# Altium schematic sheet STM32F7.SchDoc
size C
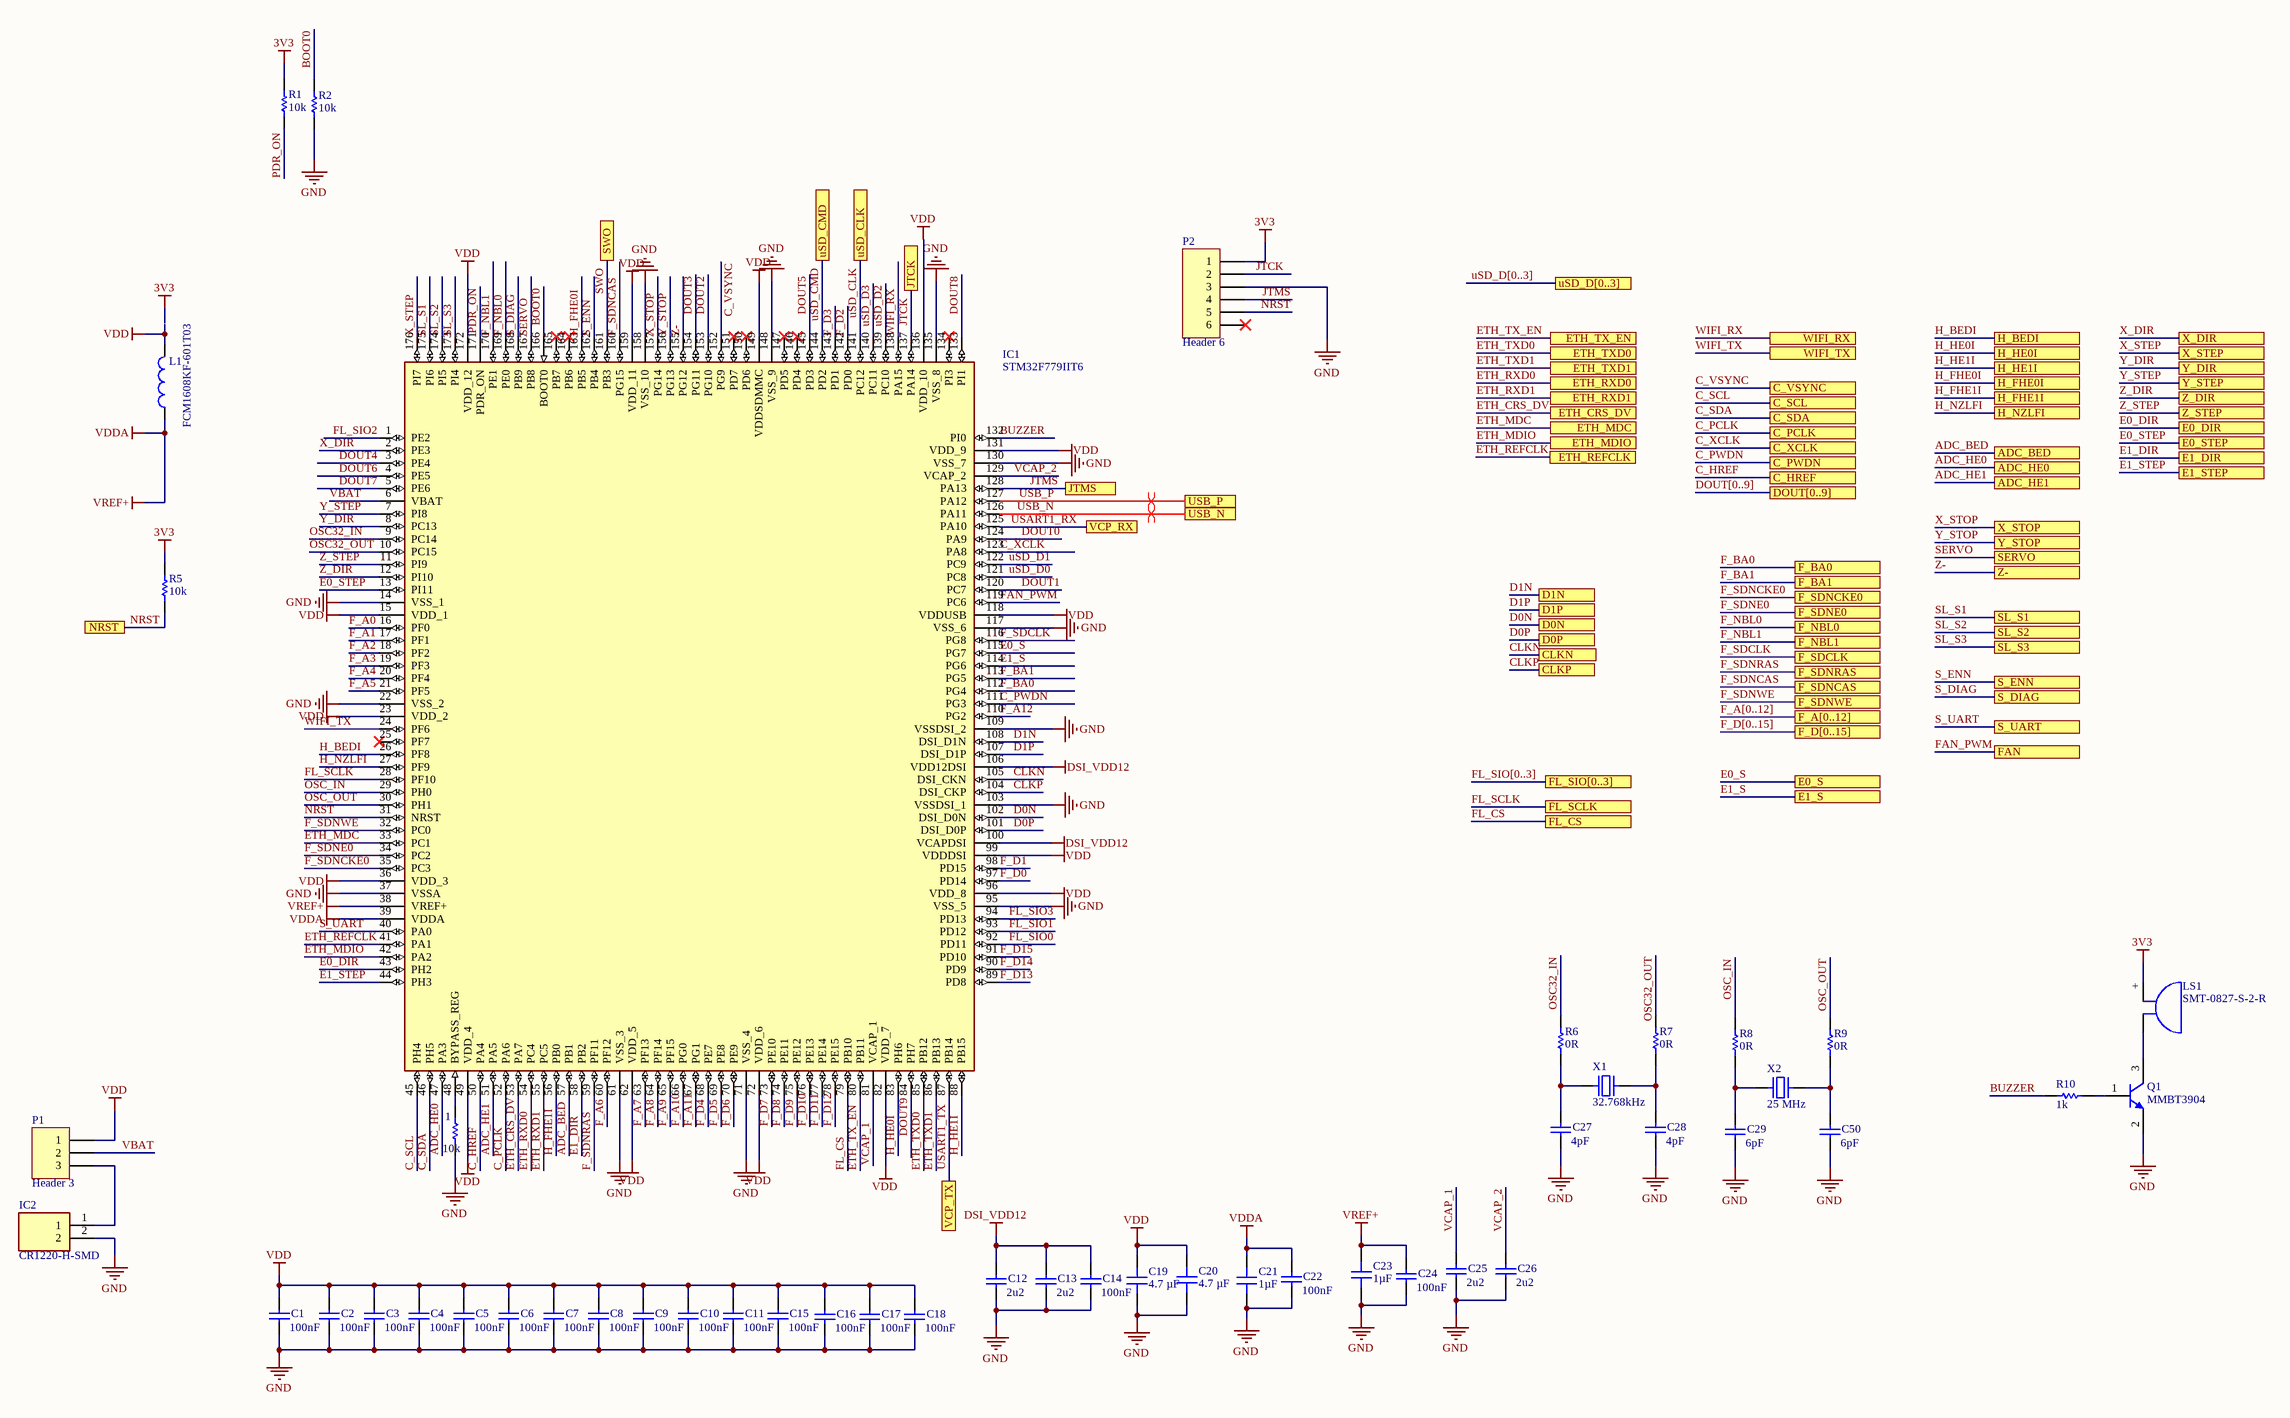
[diagram p0: STM32F7.SchDoc]

## Parts
1  value 10k  [1608[0603]]  (hidden comment: Res1)
C1  value 100nF  [1608[0603]]  (hidden comment: X5R)
C2  value 100nF  [1608[0603]]  (hidden comment: X5R)
C3  value 100nF  [1608[0603]]  (hidden comment: X5R)
C4  value 100nF  [1608[0603]]  (hidden comment: X5R)
C5  value 100nF  [1608[0603]]  (hidden comment: X5R)
C6  value 100nF  [1608[0603]]  (hidden comment: X5R)
C7  value 100nF  [1608[0603]]  (hidden comment: X5R)
C8  value 100nF  [1608[0603]]  (hidden comment: X5R)
C9  value 100nF  [1608[0603]]  (hidden comment: X5R)
C10  value 100nF  [1608[0603]]  (hidden comment: X5R)
C11  value 100nF  [1608[0603]]  (hidden comment: X5R)
C12  value 2u2  [1608[0603]]  (hidden comment: X5R)
C13  value 2u2  [1608[0603]]  (hidden comment: X5R)
C14  value 100nF  [1608[0603]]  (hidden comment: X5R)
C15  value 100nF  [1608[0603]]  (hidden comment: X5R)
C16  value 100nF  [1608[0603]]  (hidden comment: X5R)
C17  value 100nF  [1608[0603]]  (hidden comment: X5R)
C18  value 100nF  [1608[0603]]  (hidden comment: X5R)
C19  4.7 µF  [CAP 0603_1608]
C20  4.7 µF  [CAP 0603_1608]
C21  1µF  [CAP 0603_1608]
C22  value 100nF  [1608[0603]]  (hidden comment: X5R)
C23  1µF  [CAP 0603_1608]
C24  value 100nF  [1608[0603]]  (hidden comment: X5R)
C25  value 2u2  [1608[0603]]  (hidden comment: X5R)
C26  value 2u2  [1608[0603]]  (hidden comment: X5R)
C27  value 4pF  [1608[0603]]  (hidden comment: X5R)
C28  value 4pF  [1608[0603]]  (hidden comment: X5R)
C29  value 6pF  [1608[0603]]  (hidden comment: X5R)
C50  value 6pF  [1608[0603]]  (hidden comment: X5R)
IC1  STM32F779IIT6  [QFP50P2600X2600X160-176N]
IC2  CR1220-H-SMD  [CR1220HSMD]
L1  FCM1608KF-601T03  [0603L]
LS1  SMT-0827-S-2-R  [PUI Audio SMT-0827-S-2-R]
P1  Header 3  [HDR1X3]
P2  Header 6  [HDR1X6]
Q1  MMBT3904  [SOT-23_N]
R1  value 10k  [1608[0603]]  (hidden comment: Res1)
R2  value 10k  [1608[0603]]  (hidden comment: Res1)
R5  value 10k  [1608[0603]]  (hidden comment: Res1)
R6  value 0R  [1608[0603]]  (hidden comment: Res1)
R7  value 0R  [1608[0603]]  (hidden comment: Res1)
R8  value 0R  [1608[0603]]  (hidden comment: Res1)
R9  value 0R  [1608[0603]]  (hidden comment: Res1)
R10  value 1k  [1608[0603]]  (hidden comment: Res1)
X1  32.768kHz  [NDK NX5032GA]
X2  25 MHz  [NDK NX5032GA]

## Ports
ADC_BED, ADC_HE0, ADC_HE1, C_HREF, C_PCLK, C_PWDN, C_SCL, C_SDA, C_VSYNC, C_XCLK, CLKN, CLKP, D0N, D0P, D1N, D1P, DOUT[0..9], E0_DIR, E0_S, E0_STEP, E1_DIR, E1_S, E1_STEP, ETH_CRS_DV, ETH_MDC, ETH_MDIO, ETH_REFCLK, ETH_RXD0, ETH_RXD1, ETH_TX_EN, ETH_TXD0, ETH_TXD1, F_A[0..12], F_BA0, F_BA1, F_D[0..15], F_NBL0, F_NBL1, F_SDCLK, F_SDNCAS, F_SDNCKE0, F_SDNE0, F_SDNRAS, F_SDNWE, FAN, FL_CS, FL_SCLK, FL_SIO[0..3], H_BEDI, H_FHE0I, H_FHE1I, H_HE0I, H_HE1I, H_NZLFI, JTCK, JTMS, NRST, S_DIAG, S_ENN, S_UART, SERVO, SL_S1, SL_S2, SL_S3, SWO, USB_N, USB_P, uSD_CLK, uSD_CMD, uSD_D[0..3], VCP_RX, VCP_TX, WIFI_RX, WIFI_TX, X_DIR, X_STEP, X_STOP, Y_DIR, Y_STEP, Y_STOP, Z-, Z_DIR, Z_STEP

## Nets
3V3: LS1.+ P2.1 R1.1 R5.1
DSI_VDD12: C12.1 C13.1 C14.1 IC1.100(VCAPDSI) IC1.106(VDD12DSI)
GND: 1.2 C1.2 C2.2 C3.2 C4.2 C5.2 C6.2 C7.2 C8.2 C9.2 C10.2 C11.2 C12.2 C13.2 C14.2 C15.2 C16.2 C17.2 C18.2 C19.1 C20.1 C21.1 C22.2 C23.1 C24.2 C25.2 C26.2 C27.2 C28.2 C29.2 C50.2 IC1.14(VSS_1) IC1.22(VSS_2) IC1.37(VSSA) IC1.61(VSS_3) IC1.71(VSS_4) IC1.95(VSS_5) IC1.103(VSSDSI_1) IC1.109(VSSDSI_2) IC1.117(VSS_6) IC1.130(VSS_7) IC1.135(VSS_8) IC1.148(VSS_9) IC1.158(VSS_10) IC2.2 P2.3 Q1.2(E) R2.2
VDD: C1.1 C2.1 C3.1 C4.1 C5.1 C6.1 C7.1 C8.1 C9.1 C10.1 C11.1 C15.1 C16.1 C17.1 C18.1 C19.2 C20.2 IC1.15(VDD_1) IC1.23(VDD_2) IC1.36(VDD_3) IC1.49(VDD_4) IC1.62(VDD_5) IC1.72(VDD_6) IC1.82(VDD_7) IC1.96(VDD_8) IC1.99(VDDDSI) IC1.118(VDDUSB) IC1.131(VDD_9) IC1.136(VDD_10) IC1.149(VDDSDMMC) IC1.159(VDD_11) IC1.172(VDD_12) L1.2 P1.1
VDDA: C21.2 C22.1 C23.2 C24.1 IC1.38(VREF+) IC1.39(VDDA) L1.1  [also labelled VREF+]
ADC_BED: IC1.57(PB1) ; port ADC_BED
ADC_HE0: IC1.47(PA3) ; port ADC_HE0
ADC_HE1: IC1.51(PA5) ; port ADC_HE1
BOOT0: IC1.166(BOOT0) R2.1
BUZZER: IC1.132(PI0) R10.1
C_HREF: IC1.50(PA4) ; port C_HREF
C_PCLK: IC1.52(PA6) ; port C_PCLK
C_PWDN: IC1.111(PG3) ; port C_PWDN
C_SCL: IC1.45(PH4) ; port C_SCL
C_SDA: IC1.46(PH5) ; port C_SDA
C_VSYNC: IC1.152(PG9) ; port C_VSYNC
C_XCLK: IC1.123(PA8) ; port C_XCLK
CLKN: IC1.105(DSI_CKN) ; port CLKN
CLKP: IC1.104(DSI_CKP) ; port CLKP
D0N: IC1.102(DSI_D0N) ; port D0N
D0P: IC1.101(DSI_D0P) ; port D0P
D1N: IC1.108(DSI_D1N) ; port D1N
D1P: IC1.107(DSI_D1P) ; port D1P
DOUT0: IC1.124(PA9)
DOUT1: IC1.120(PC7)
DOUT2: IC1.153(PG10)
DOUT3: IC1.154(PG11)
DOUT4: IC1.3(PE4)
DOUT5: IC1.145(PD3)
DOUT6: IC1.4(PE5)
DOUT7: IC1.5(PE6)
DOUT8: IC1.133(PI1)
DOUT9: IC1.84(PH7)
E0_DIR: IC1.43(PH2) ; port E0_DIR
E0_S: IC1.115(PG7) ; port E0_S
E0_STEP: IC1.13(PI11) ; port E0_STEP
E1_DIR: IC1.58(PB2) ; port E1_DIR
E1_S: IC1.114(PG6) ; port E1_S
E1_STEP: IC1.44(PH3) ; port E1_STEP
ETH_CRS_DV: IC1.53(PA7) ; port ETH_CRS_DV
ETH_MDC: IC1.33(PC1) ; port ETH_MDC
ETH_MDIO: IC1.42(PA2) ; port ETH_MDIO
ETH_REFCLK: IC1.41(PA1) ; port ETH_REFCLK
ETH_RXD0: IC1.54(PC4) ; port ETH_RXD0
ETH_RXD1: IC1.55(PC5) ; port ETH_RXD1
ETH_TX_EN: IC1.80(PB11) ; port ETH_TX_EN
ETH_TXD0: IC1.85(PB12) ; port ETH_TXD0
ETH_TXD1: IC1.86(PB13) ; port ETH_TXD1
F_A0: IC1.16(PF0)
F_A1: IC1.17(PF1)
F_A2: IC1.18(PF2)
F_A3: IC1.19(PF3)
F_A4: IC1.20(PF4)
F_A5: IC1.21(PF5)
F_A6: IC1.60(PF12)
F_A7: IC1.63(PF13)
F_A8: IC1.64(PF14)
F_A9: IC1.65(PF15)
F_A10: IC1.66(PG0)
F_A11: IC1.67(PG1)
F_A12: IC1.110(PG2)
F_BA0: IC1.112(PG4) ; port F_BA0
F_BA1: IC1.113(PG5) ; port F_BA1
F_D0: IC1.97(PD14)
F_D1: IC1.98(PD15)
F_D2: IC1.142(PD0)
F_D3: IC1.143(PD1)
F_D4: IC1.68(PE7)
F_D5: IC1.69(PE8)
F_D6: IC1.70(PE9)
F_D7: IC1.73(PE10)
F_D8: IC1.74(PE11)
F_D9: IC1.75(PE12)
F_D10: IC1.76(PE13)
F_D11: IC1.77(PE14)
F_D12: IC1.78(PE15)
F_D13: IC1.89(PD8)
F_D14: IC1.90(PD9)
F_D15: IC1.91(PD10)
F_NBL0: IC1.169(PE0) ; port F_NBL0
F_NBL1: IC1.170(PE1) ; port F_NBL1
F_SDCLK: IC1.116(PG8) ; port F_SDCLK
F_SDNCAS: IC1.160(PG15) ; port F_SDNCAS
F_SDNCKE0: IC1.35(PC3) ; port F_SDNCKE0
F_SDNE0: IC1.34(PC2) ; port F_SDNE0
F_SDNRAS: IC1.59(PF11) ; port F_SDNRAS
F_SDNWE: IC1.32(PC0) ; port F_SDNWE
FAN_PWM: IC1.119(PC6) ; port FAN
FL_CS: IC1.79(PB10) ; port FL_CS
FL_SCLK: IC1.28(PF10) ; port FL_SCLK
FL_SIO0: IC1.92(PD11)
FL_SIO1: IC1.93(PD12)
FL_SIO2: IC1.1(PE2)
FL_SIO3: IC1.94(PD13)
H_BEDI: IC1.26(PF8) ; port H_BEDI
H_FHE0I: IC1.163(PB5) ; port H_FHE0I
H_FHE1I: IC1.56(PB0) ; port H_FHE1I
H_HE0I: IC1.83(PH6) ; port H_HE0I
H_HE1I: IC1.88(PB15) ; port H_HE1I
H_NZLFI: IC1.27(PF9) ; port H_NZLFI
JTCK: IC1.137(PA14) P2.2 ; port JTCK
JTMS: IC1.128(PA13) P2.4 ; port JTMS
NRST: IC1.31(NRST) P2.5 R5.2 ; port NRST
OSC32_IN: IC1.9(PC14) R6.1
OSC32_OUT: IC1.10(PC15) R7.1
OSC_IN: IC1.29(PH0) R8.1
OSC_OUT: IC1.30(PH1) R9.1
PDR_ON: IC1.171(PDR_ON) R1.2
S_DIAG: IC1.168(PB9) ; port S_DIAG
S_ENN: IC1.162(PB4) ; port S_ENN
S_UART: IC1.40(PA0) ; port S_UART
SERVO: IC1.167(PB8) ; port SERVO
SL_S1: IC1.175(PI6) ; port SL_S1
SL_S2: IC1.174(PI5) ; port SL_S2
SL_S3: IC1.173(PI4) ; port SL_S3
SWO: IC1.161(PB3) ; port SWO
USART1_RX: IC1.125(PA10) ; port VCP_RX
USART1_TX: IC1.87(PB14) ; port VCP_TX
USB_N: IC1.126(PA11) ; port USB_N
USB_P: IC1.127(PA12) ; port USB_P
uSD_CLK: IC1.141(PC12) ; port uSD_CLK
uSD_CMD: IC1.144(PD2) ; port uSD_CMD
uSD_D0: IC1.121(PC8)
uSD_D1: IC1.122(PC9)
uSD_D2: IC1.139(PC10)
uSD_D3: IC1.140(PC11)
VBAT: IC1.6(VBAT) P1.2
VCAP_1: C25.1 IC1.81(VCAP_1)
VCAP_2: C26.1 IC1.129(VCAP_2)
WIFI_RX: IC1.138(PA15) ; port WIFI_RX
WIFI_TX: IC1.24(PF6) ; port WIFI_TX
X_DIR: IC1.2(PE3) ; port X_DIR
X_STEP: IC1.176(PI7) ; port X_STEP
X_STOP: IC1.157(PG14) ; port X_STOP
Y_DIR: IC1.8(PC13) ; port Y_DIR
Y_STEP: IC1.7(PI8) ; port Y_STEP
Y_STOP: IC1.156(PG13) ; port Y_STOP
Z-: IC1.155(PG12) ; port Z-
Z_DIR: IC1.12(PI10) ; port Z_DIR
Z_STEP: IC1.11(PI9) ; port Z_STEP
Net1_1: 1.1 IC1.48(BYPASS_REG)
NetC27_1: C27.1 R6.2 X1.1
NetC28_1: C28.1 R7.2 X1.2
NetC29_1: C29.1 R8.2 X2.1
NetC50_1: C50.1 R9.2 X2.2
NetIC2_1: IC2.1 P1.3
NetLS1_-: LS1.- Q1.3(C)
NetQ1_1: Q1.1(B) R10.2

Not connected (* = marked no-connect by the designer): IC1 25(PF7)* 134(PI3)* 146(PD4)* 147(PD5)* 150(PD6)* 151(PD7)* 164(PB6)* 165(PB7)*; P2 6*

## Buses and harness runs
bus DOUT[0..9] = port DOUT[0..9]
bus F_A[0..12] = port F_A[0..12]
bus F_D[0..15] = port F_D[0..15]
bus FL_SIO[0..3] = port FL_SIO[0..3]
bus uSD_D[0..3] = port uSD_D[0..3]

## Layout directives
differential pair: USB_N, USB_P

## Library data of the parts
1 R1 R2 R5-R10 = Res1: Resistor; Published: 8-Jun-2000; LatestRevisionDate: 17-Jul-2002; LatestRevisionNote: Re-released for DXP Platform.; PackageReference: AXIAL-0.3; Publisher: Altium Limited; PackageDescription: Axial Device, Thru-Hole; 2 Leads; 0.3 in Pin Spacing
C1-C18 C22 C24-C29 C50 = Cap: Capacitor; Published: 8-Jun-2000; LatestRevisionDate: 17-Jul-2002; LatestRevisionNote: Re-released for DXP Platform.; PackageReference: RAD-0.3; Publisher: Altium Limited; PackageDescription: Radial Cap, Thru-Hole; 2 Leads; 0.3 in Pin Spacing
C19 C20 = GRM185R61C475KE11D: CAP CER 4.7UF 16V X5R 0603; manufacturer: Murata Electronics; Tolerance: ±10%; Part Number: GRM185R61C475KE11D; Value: 4.7 µF; Applications: General Purpose; Capacitance: 4.7 µF; componentlink1description: Datasheet; componentlink1url: https://search.murata.co.jp/Ceramy/image/img/A01X/G101/ENG/GRM185R61C475KE11-01.pdf; componentlink2description: DigiKey Link; componentlink2url: https://www.digikey.com/en/products/detail/murata-electronics/GRM185R61C475KE11D/6606088; Device Package: 0603 (1608 Metric); lastupdated: 3/28/2023 7:09:04 PM; Lifecycle Status: Active; Minimum Order: 1; Mounting Type: Surface Mount, MLCC; Operating Temperature: -55°C ~ 85°C; Package / Case: 0603 (1608 Metric); packaging: TapeAndReel; partid: 2451; Part Status: Active; price: 0.05; series: GRM; Size / Dimension: 0.063" L x 0.031" W (1.60mm x 0.80mm); Supplier 1: DigiKey; Supplier Part Number 1: 490-14459-1-ND; Temperature Coefficient: X5R; Thickness (Max): 0.022" (0.55mm); Voltage - Rated: 16V
C21 C23 = 0603YD105KAT4A: CAP CER 1UF 16V X5R 0603; manufacturer: AVX Corporation; Tolerance: ±10%; Part Number: 0603YD105KAT4A; Value: 1µF; Applications: General Purpose; Capacitance: 1µF; componentlink1description: Datasheet; componentlink1url: http://datasheets.avx.com/cx5r.pdf; componentlink2description: DigiKey Link; componentlink2url: http://digikey.com/product-detail/en/avx-corporation/0603YD105KAT4A/478-10365-1-ND/6797443; Device Package: 0603 (1608 Metric); lastupdated: 9/2/2020 1:03:10 AM; Lifecycle Status: Active; Minimum Order: 1; Mounting Type: Surface Mount, MLCC; Operating Temperature: -55°C ~ 85°C; Package / Case: 0603 (1608 Metric); packaging: TapeAndReel; partid: 15257; Part Status: Active; price: 0.03; series: -; Size / Dimension: 0.063" L x 0.032" W (1.60mm x 0.81mm); Supplier 1: DigiKey; Supplier Part Number 1: 478-10365-1-ND; Temperature Coefficient: X5R; Thickness (Max): 0.035" (0.90mm); Voltage - Rated: 16V
IC1 = STM32F779IIT6: Integrated Circuit; Manufacturer_Name: STMicroelectronics; Datasheet Link: https://www.arrow.com/en/products/stm32f779iit6/stmicroelectronics; Height: 1.6mm; Manufacturer_Part_Number: STM32F779IIT6; Mouser Part Number: 511-STM32F779IIT6; Mouser Price/Stock: https://www.mouser.co.uk/ProductDetail/STMicroelectronics/STM32F779IIT6?qs=qzCNEk%252BRr%252BabClKc4EG9PA%3D%3D; Arrow Part Number: STM32F779IIT6; Arrow Price/Stock: https://www.arrow.com/en/products/stm32f779iit6/stmicroelectronics?region=nac
IC2 = CR1220-H-SMD: Integrated Circuit; Manufacturer_Name: ROBOTIS; Datasheet Link: https://www.robotics.org.za/CR1220-H-SMD; Height: 4.1mm; Manufacturer_Part_Number: CR1220-H-SMD
L1 = Inductor: Value: 100uH; Published: 8-Jun-2000; Revision: July-2002: Re-released for DXP Platform.; Publisher: Altium Limited
LS1 = SMT-0827-S-2-R: AUDIO MAGNETIC XDCR 2.5-4.5V SMD; Manufacturer: PUI Audio, Inc.; Current - Supply: 90mA; Driver Circuitry: Transducer, Externally Driven; Frequency: 2.7kHz; Input Type: Zero-Peak Signal; Operating Mode: Single Tone; Port Location: Side; Sound Pressure Level (SPL): 92dB @ 3.6V, 10cm; Voltage Range: 2.5 ~ 4.5V; Voltage - Rated: 3.6V; Part Number: SMT-0827-S-2-R; ComponentLink1Description: Datasheet; ComponentLink1URL: http://www.puiaudio.com/pdf/SMT-0827-S-2-R.pdf; ComponentLink2Description: DigiKey Link; ComponentLink2URL: http://digikey.com/product-detail/en/pui-audio-inc/SMT-0827-S-2-R/668-1072-1-ND/1464939; Height - Seated (Max): 0.177" (4.50mm); LastUpdated: 4/24/2020 12:38:09 AM; Lifecycle Status: Active; Minimum Order: 1; Mounting Type: Surface Mount; Operating Temperature: -30°C ~ 70°C; Packaging: TapeAndReel; Part Status: Active; Price: 2.03; Series: SMT; Size / Dimension: 0.335" L x 0.335" W (8.50mm x 8.50mm); Supplier 1: DigiKey; Supplier Part Number 1: 668-1072-1-ND; Technology: Magnetic; Termination: Solder Pads
P1 = Header 3: Header, 3-Pin; LatestRevisionDate: 17-Jul-2002; LatestRevisionNote: Re-released for DXP Platform.; Publisher: Altium Limited
P2 = Header 6: Header, 6-Pin; LatestRevisionDate: 17-Jul-2002; LatestRevisionNote: Re-released for DXP Platform.; Publisher: Altium Limited
Q1 = MMBT3904TT1G: TRANS NPN 40V 0.2A SOT416; Manufacturer: ON Semiconductor; Current - Collector (Ic) (Max): 200mA; DC Current Gain (hFE) (Min) @ Ic, Vce: 100 @ 10mA, 1V; Frequency - Transition: 300MHz; Power - Max: 300mW; Vce Saturation (Max) @ Ib, Ic: 300mV @ 5mA, 50mA; Part Number: MMBT3904TT1G; ComponentLink1Description: Datasheet; ComponentLink1URL: https://www.onsemi.com/pub/Collateral/MMBT3904TT1-D.PDF; ComponentLink2Description: DigiKey Link; ComponentLink2URL: http://digikey.com/product-detail/en/on-semiconductor/MMBT3904TT1G/MMBT3904TT1GOSCT-ND/1139815; LastUpdated: 2/1/2023 9:06:25 PM; Lifecycle Status: Active; Minimum Order: 1; Mounting Type: Surface Mount; Operating Temperature: -55°C ~ 150°C (TJ); Package / Case: SC-75, SOT-416; Packaging: TapeAndReel; PartId: 34; Part Status: Active; Price: 0.02; Series: -; Supplier 1: DigiKey; Supplier Part Number 1: MMBT3904TT1GOSCT-ND; Supplier Device Package: SC-75, SOT-416; Transistor Type: NPN; Voltage - Collector Emitter Breakdown (Max): 40V
X1 = NX5032GA-25.000000MHZ-LN-CD-1: CRYSTAL 25.0000MHZ 8PF SMD; Manufacturer: NDK America, Inc.; ESR (Equivalent Series Resistance): 70 Ohms; Frequency: 25 MHz; Frequency Stability: ±50ppm; Operating Mode: Fundamental; Value: 25 MHz; Part Number: NX5032GA-25.000000MHZ-LN-CD-1; ComponentLink1Description: Datasheet; ComponentLink1URL: //media.digikey.com/pdf/Data%20Sheets/NDK%20PDFs/NX5032GA.pdf; ComponentLink2Description: DigiKey Link; ComponentLink2URL: https://www.digikey.com/en/products/detail/ndk-america-inc/NX5032GA-25-000000MHZ-LN-CD-1/1128823; Frequency Tolerance: ±50ppm; Height - Seated (Max): 0.059" (1.50mm); LastUpdated: 3/28/2023 8:00:45 PM; Lifecycle Status: Active; Load Capacitance: 8pF; Minimum Order: 1; Mounting Type: Surface Mount; Operating Temperature: -10°C ~ 70°C; Package / Case: 2-SMD, No Lead; Packaging: TapeAndReel; PartId: 621; Part Status: Active; Price: 0.28; Series: NX5032GA; Size / Dimension: 0.197" L x 0.126" W (5.00mm x 3.20mm); Supplier 1: DigiKey; Supplier Part Number 1: 644-1041-1-ND; Type: MHz Crystal
X2 = NX5032GA-25.000000MHZ-LN-CD-1: CRYSTAL 25.0000MHZ 8PF SMD; Manufacturer: NDK America, Inc.; ESR (Equivalent Series Resistance): 70 Ohms; Frequency Stability: ±50ppm; Operating Mode: Fundamental; Part Number: NX5032GA-25.000000MHZ-LN-CD-1; ComponentLink1Description: Datasheet; ComponentLink1URL: //media.digikey.com/pdf/Data%20Sheets/NDK%20PDFs/NX5032GA.pdf; ComponentLink2Description: DigiKey Link; ComponentLink2URL: https://www.digikey.com/en/products/detail/ndk-america-inc/NX5032GA-25-000000MHZ-LN-CD-1/1128823; Frequency: 25 MHz; Frequency Tolerance: ±50ppm; Height - Seated (Max): 0.059" (1.50mm); LastUpdated: 3/28/2023 8:00:45 PM; Lifecycle Status: Active; Load Capacitance: 8pF; Minimum Order: 1; Mounting Type: Surface Mount; Operating Temperature: -10°C ~ 70°C; Package / Case: 2-SMD, No Lead; Packaging: TapeAndReel; PartId: 621; Part Status: Active; Price: 0.28; Series: NX5032GA; Size / Dimension: 0.197" L x 0.126" W (5.00mm x 3.20mm); Supplier 1: DigiKey; Supplier Part Number 1: 644-1041-1-ND; Type: MHz Crystal; Value: 25 MHz